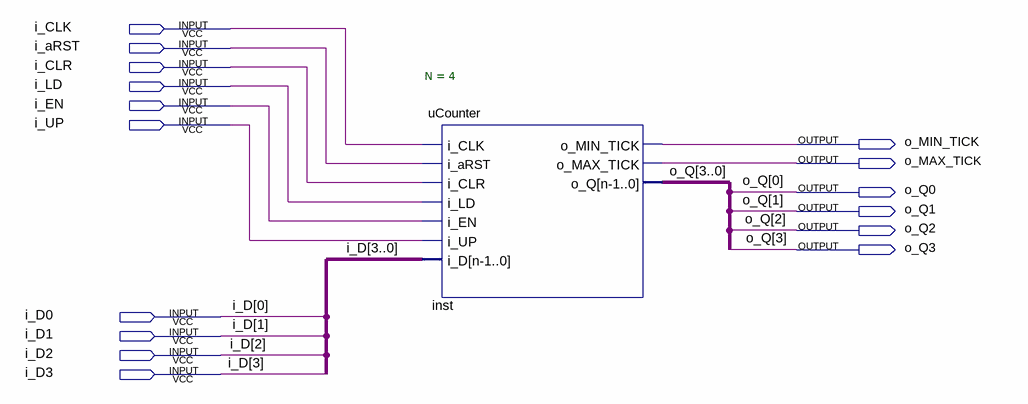
[diagram p0: schematic sheet]
// Quartus schematic Universal_Counter_sch.bdf as structural Verilog: 1 symbols, 16 pins
module Universal_Counter_sch (
  input  i_CLK,
  input  i_aRST,
  input  i_CLR,
  input  i_LD,
  input  i_EN,
  input  i_UP,
  input  i_D0,
  input  i_D1,
  input  i_D2,
  input  i_D3,
  output o_MIN_TICK,
  output o_MAX_TICK,
  output o_Q0,
  output o_Q1,
  output o_Q2,
  output o_Q3
);

  uCounter #(.N(4)) inst (
    .i_CLK(i_CLK), .i_aRST(i_aRST), .i_CLR(i_CLR), .i_LD(i_LD), .i_EN(i_EN), .i_UP(i_UP),
    .i_D({i_D3, i_D2, i_D1, i_D0}), .o_MIN_TICK(o_MIN_TICK), .o_MAX_TICK(o_MAX_TICK),
    .o_Q({o_Q3, o_Q2, o_Q1, o_Q0}));
endmodule
